# Altium schematic sheet Power - Regulators.SchDoc
size A4; SheetNumber: 1; SheetTotal: 8
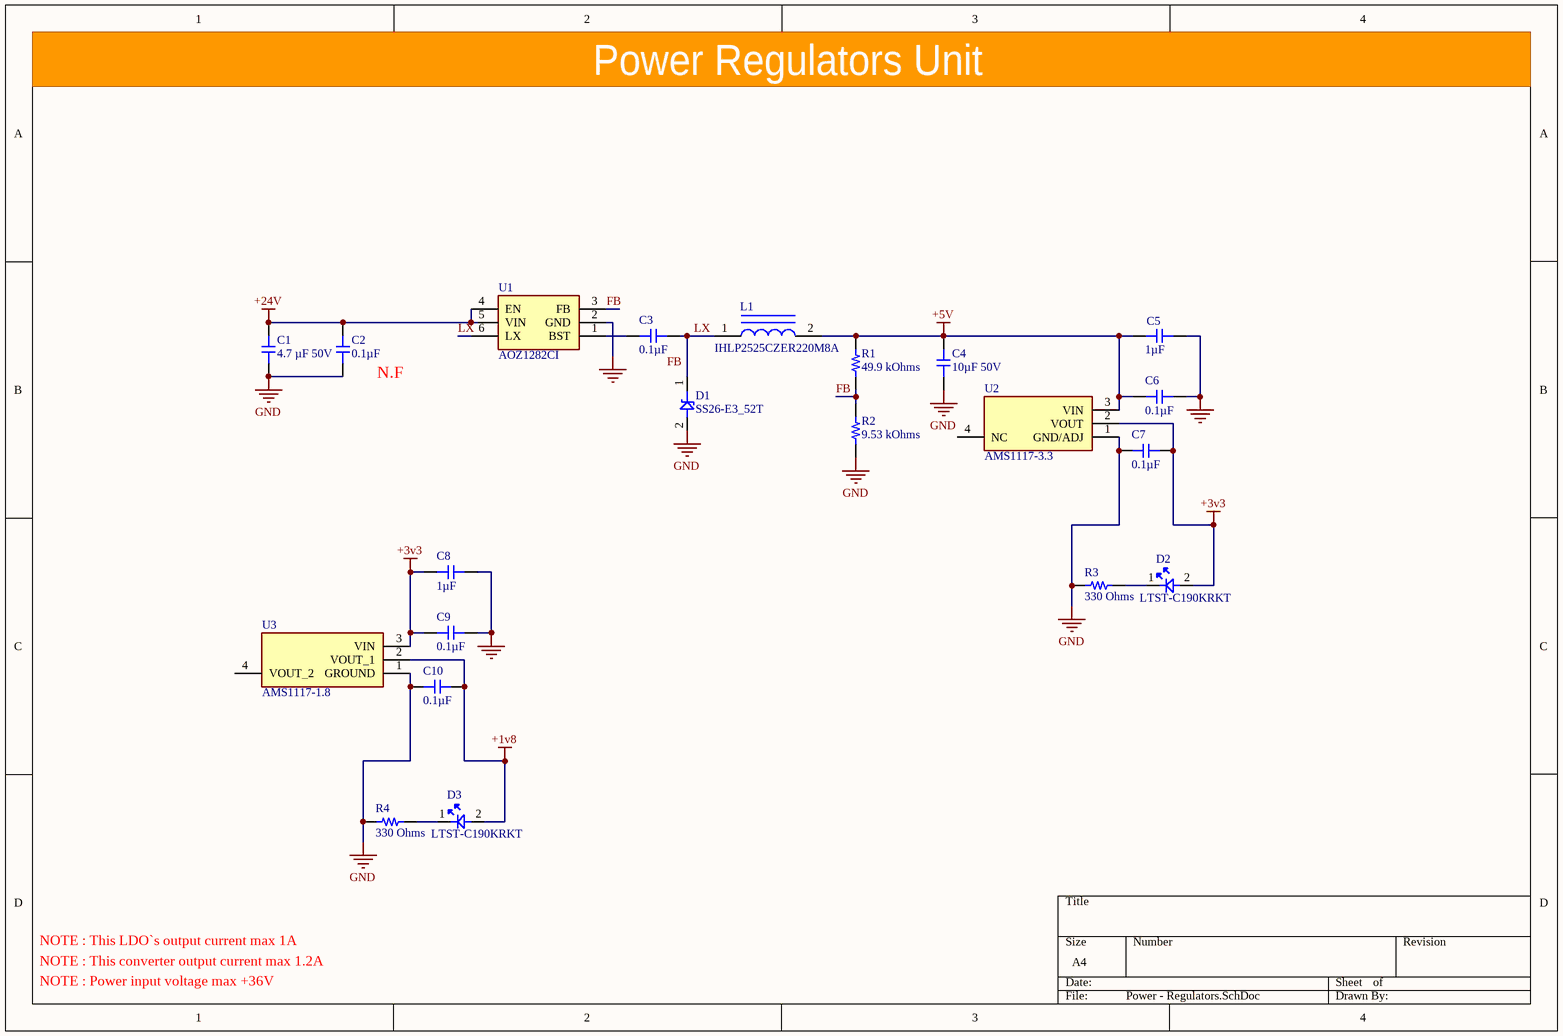
[diagram p0: Power - Regulators.SchDoc]

## Parts
C1  4.7 µF 50V  [1206_10uF]
C2  0.1µF  [0805]
C3  0.1µF  [0805]
C4  10µF 50V  [1206_10uF]
C5  1µF  [0603_Footprint]
C6  0.1µF  [0603_Footprint]
C7  0.1µF  [0603_Footprint]
C8  1µF  [0603_Footprint]
C9  0.1µF  [0603_Footprint]
C10  0.1µF  [0603_Footprint]
D1  SS26-E3_52T  [DIOM5436X244N]
D2  LTST-C190KRKT  [LEDC1608X80N]
D3  LTST-C190KRKT  [LEDC1608X80N]
L1  IHLP2525CZER220M8A  [INDPM6965X300N]
R1  49.9 kOhms  [0603_RES]
R2  9.53 kOhms  [0603_RES]
R3  330 Ohms  [0603_RES]
R4  330 Ohms  [0603_RES]
U1  AOZ1282CI  [SOT95P280X125-6N]
U2  AMS1117-3.3  [SOT229P700X180-4N]
U3  AMS1117-1.8  [SOT229P700X180-4N]

## Nets
+1v8: C10.2 D3.2(A) U3.2(VOUT_1)
+3v3: C7.2 C8.1 C9.1 D2.2(A) U2.2(VOUT) U3.3(VIN)
+5V: C4.1 C5.1 C6.1 L1.2 R1.2 U2.3(VIN)
+24V: C1.1 C2.2 U1.4(EN) U1.5(VIN)
GND: C1.2 C2.1 C4.2 C5.2 C6.2 C7.1 C8.2 C9.2 C10.1 D1.2(A) R2.1 R3.1 R4.1 U1.2(GND) U2.1(GND/ADJ) U3.1(GROUND)
FB: R1.1 R2.2 U1.3(FB)
LX: C3.2 D1.1(K) L1.1 U1.6(LX)
NetC3_1: C3.1 U1.1(BST)
NetD2_1: D2.1(K) R3.2
NetD3_1: D3.1(K) R4.2

Not connected (* = marked no-connect by the designer): U2 4(NC); U3 4(VOUT_2)

## Notes on the sheet
- Power Regulators Unit
- (near C2) N.F
- NOTE : This converter output current max 1.2A
- NOTE : This LDO`s output current max 1A
- NOTE : Power input voltage max +36V
- Labels drawn without touching a wire or pin: FB

## Library data of the parts
C1 = 4.7 uF 50V 1206: 10 uF 50V 1206
C2 C3 = 0.1uF 0805 Surface Capacitor
C4 = 10 uF 50V 1206
C5 C8 = 1uF 0603 Surface Capacitor
C6 C7 C9 C10 = 0.1uF 0603 Surface Capacitor
D1 = SS26-E3_52T: Schottky Diode; Manufacturer_Name: Vishay; Manufacturer_Part_Number: SS26-E3/52T; Datasheet Link: https://componentsearchengine.com/Datasheets/2/SS26-E3_52T.pdf; Height: 2.44mm; Mouser Part Number: 625-SS26-E3; Mouser Price/Stock: https://www.mouser.co.uk/ProductDetail/Vishay-General-Semiconductor/SS26-E3-52T?qs=x2jpVgRnAtNToatHaCRUvw%3D%3D; Arrow Part Number: SS26-E3/52T; Arrow Price/Stock: https://www.arrow.com/en/products/ss26-e352t/vishay?region=europe
D2 D3 = LTST-C190KRKT: LED; Manufacturer_Name: Lite-On; Datasheet Link: https://componentsearchengine.com/Datasheets/1/LTST-C190KRKT.pdf; Height: 0.8mm; Manufacturer_Part_Number: LTST-C190KRKT; Mouser Part Number: 859-LTST-C190KRKT; Mouser Price/Stock: https://www.mouser.co.uk/ProductDetail/Lite-On/LTST-C190KRKT?qs=kAD5fFa1n5VY3YYNWPC1Fg%3D%3D; Arrow Part Number: LTST-C190KRKT; Arrow Price/Stock: https://www.arrow.com/en/products/ltst-c190krkt/lite-on-technology?region=europe
L1 = IHLP2525CZER220M8A: Inductor; Manufacturer_Name: Vishay; Datasheet Link: https://componentsearchengine.com/Datasheets/2/IHLP2525CZER220M8A.pdf; Height: 3mm; Manufacturer_Part_Number: IHLP2525CZER220M8A; Mouser Part Number: 70-IHLP2525CZR220M8A; Mouser Price/Stock: https://www.mouser.co.uk/ProductDetail/Vishay-Dale/IHLP2525CZER220M8A?qs=ei%2FvZTf36ZyKyW60gc1ORQ%3D%3D; Arrow Part Number: IHLP2525CZER220M8A; Arrow Price/Stock: https://www.arrow.com/en/products/ihlp2525czer220m8a/vishay
R1 = 49.9 kOhms 0603
R2 = 9.53 kOhms 0603
R3 R4 = 330 Ohm 0603
U1 = AOZ1282CI: Integrated Circuit; Manufacturer_Name: Alpha & Omega Semiconductors; Datasheet Link: http://www.aosmd.com/res/data_sheets/AOZ1282CI.pdf; Height: 1.25mm; Manufacturer_Part_Number: AOZ1282CI; Arrow Part Number: AOZ1282CI; Arrow Price/Stock: https://www.arrow.com/en/products/aoz1282ci/alpha-and-omega-semiconductor?region=nac
U2 = AMS1117-3.3: Integrated Circuit; Manufacturer_Name: Advanced; Datasheet Link: https://datasheet.datasheetarchive.com/originals/distributors/Datasheets-28/DSA-550594.pdf; Height: 1.8mm; Manufacturer_Part_Number: AMS1117-3.3
U3 = AMS1117-1.8: Integrated Circuit; Manufacturer_Name: Advanced Monolithic Systems; Datasheet Link: https://datasheet.datasheetarchive.com/originals/distributors/Datasheets-1/DSA-6085.pdf; Height: 1.8mm; Manufacturer_Part_Number: AMS1117-1.8